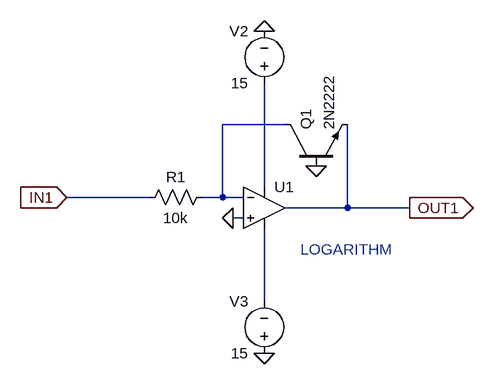
[diagram p0: schematic logblock.asc]
logblock.asc, the LTspice schematic file:
Version 4.1
SHEET 1 900 680
WIRE 144 64 48 64
WIRE 112 160 112 0
WIRE -64 176 -192 176
WIRE 48 176 48 64
WIRE 48 176 16 176
WIRE 80 176 48 176
WIRE 240 192 240 64
WIRE 240 192 144 192
WIRE 336 192 240 192
WIRE 80 208 64 208
WIRE 112 336 112 224
FLAG 112 -80 0
FLAG 112 416 0
FLAG 64 208 0
FLAG 192 128 0
FLAG -192 176 IN1
IOPIN -192 176 In
FLAG 336 192 OUT1
IOPIN 336 192 Out
SYMBOL OpAmps\\UniversalOpAmp 112 192 R0
SYMATTR InstName U1
SYMBOL res 32 160 R90
WINDOW 0 0 56 VBottom 2
WINDOW 3 32 56 VTop 2
SYMATTR InstName R1
SYMATTR Value 10k
SYMBOL voltage 112 16 R180
WINDOW 0 24 96 Left 2
WINDOW 3 24 16 Left 2
WINDOW 123 0 0 Left 0
WINDOW 39 0 0 Left 0
SYMATTR InstName V2
SYMATTR Value 15
SYMBOL voltage 112 432 R180
WINDOW 0 24 96 Left 2
WINDOW 3 24 16 Left 2
WINDOW 123 0 0 Left 0
WINDOW 39 0 0 Left 0
SYMATTR InstName V3
SYMATTR Value 15
SYMBOL npn 144 128 R270
SYMATTR InstName Q1
SYMATTR Value 2N2222
TEXT 168 256 Left 2 ;LOGARITHM

The netlist it stands for:
* logblock.asc
X§U1 0 N001 N002 N003 OUT1 level1 Avol=1Meg GBW=10Meg Vos=0 En=0 Enk=0 In=0 Ink=0 Rin=500Meg  ; pins In+ In- V+ V- OUT
R1 N001 IN1 10k
V2 N002 0 15
V3 0 N003 15
Q1 N001 0 OUT1 0 2N2222
.model NPN NPN
.model PNP PNP
.lib standard.bjt
* LOGARITHM
.lib UniversalOpAmp1.lib
.backanno
.end